# EAGLE design RevE-light (EAGLE 6.4)

## Sheet 1 of 2
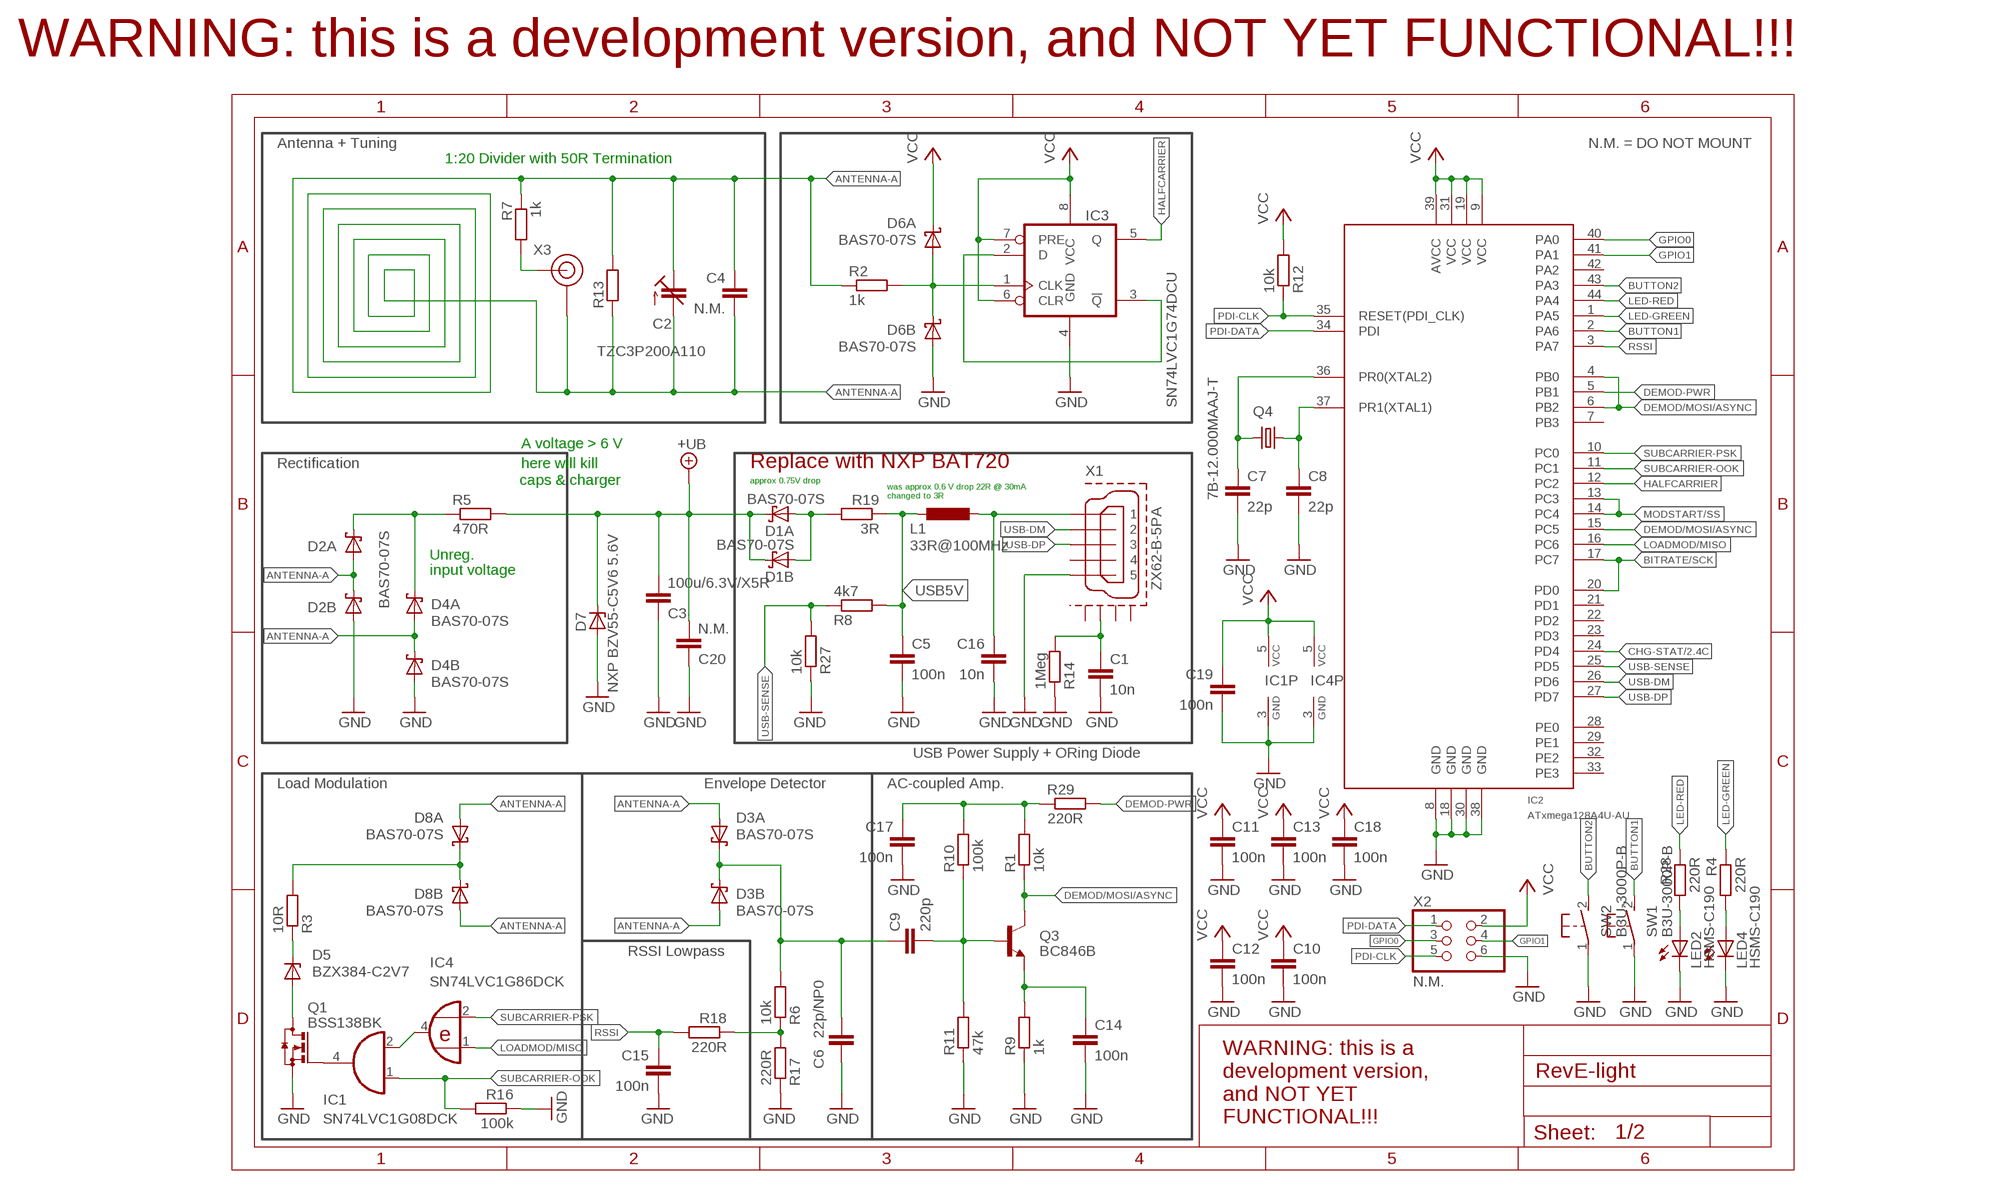
[diagram p0: schematic, sheet 1]

### Parts
C1  10n  C-EUC1206K  [C1206K]
C2  TZC3P200A110  TZC3P  [TZC3P]
C3  100u/6.3V/X5R  C-EUC1206K  [C1206K]
C4  N.M.  C-EUC1206  [C1206]
C5  100n  C-EUC1206K  [C1206K]
C6  22p/NP0  C-EUC0603K  [C0603K]
C7  22p  C-EUC0603K  [C0603K]
C8  22p  C-EUC0603K  [C0603K]
C9  220p  C-EUC0603K  [C0603K]
C10  100n  C-EUC0603K  [C0603K]
C11  100n  C-EUC0603K  [C0603K]
C12  100n  C-EUC0603K  [C0603K]
C13  100n  C-EUC0603K  [C0603K]
C14  100n  C-EUC0603K  [C0603K]
C15  100n  C-EUC0603K  [C0603K]
C16  10n  C-EUC1206K  [C1206K]
C17  100n  C-EUC0603K  [C0603K]
C18  100n  C-EUC0603K  [C0603K]
C19  100n  C-EUC0603K  [C0603K]
C20  N.M.  C-EUC1206K  [C1206K]
D1  BAS70-07S  [SOT363_PHILIPS]
D2  BAS70-07S  [SOT363_PHILIPS]
D3  BAS70-07S  [SOT363_PHILIPS]
D4  BAS70-07S  [SOT363_PHILIPS]
D5  BZX384-C2V7  BZX384  [SOD323]
D6  BAS70-07S  [SOT363_PHILIPS]
D7  NXP BZV55-C5V6 5.6V  ZENER-DIODESOD80C  [SOD80C]
D8  BAS70-07S  [SOT363_PHILIPS]
IC1  SN74LVC1G08DCK  74LVC1G08DCK  [SC70-5]
IC2  ATxmega128A4U-AU  ATXMEGA_A4-A  [TQFP44]
IC3  SN74LVC1G74DCU  74LVC1G74DC  [VSSOP8]
IC4  SN74LVC1G86DCK  74AHC1G86DCK  [SC70-5]
L1  33R@100MHz  L-EUL2012C  [L2012C]
LED2  HSMS-C190  LEDCHIPLED_0603  [CHIPLED_0603]
LED4  HSMS-C190  LEDCHIPLED_0603  [CHIPLED_0603]
Q1  BSS138BK  BSS123  [SOT23]
Q3  BC846B  BC846BSMD  [SOT23]
Q4  7B-12.000MAAJ-T  TXC7B  [5MMX3.2MM]
R1  10k  R-EU_R0603  [R0603]
R2  1k  R-EU_R0603  [R0603]
R3  10R  R-EU_R0603  [R0603]
R4  220R  R-EU_R0603  [R0603]
R5  470R  R-EU_R1206  [R1206]
R6  10k  R-EU_R0603  [R0603]
R7  1k  R-EU_R1206  [R1206]
R8  4k7  R-EU_R0603  [R0603]
R9  1k  R-EU_R0603  [R0603]
R10  100k  R-EU_R0603  [R0603]
R11  47k  R-EU_R0603  [R0603]
R12  10k  R-EU_R0603  [R0603]
R13  R-EU_M1206  [M1206]
R14  1Meg  R-EU_M0805  [M0805]
R16  100k  R-EU_R0603  [R0603]
R17  220R  R-EU_R0603  [R0603]
R18  220R  R-EU_R0603  [R0603]
R19  3R  R-EU_M0805  [M0805]
R27  10k  R-EU_R0603  [R0603]
R28  220R  R-EU_R0603  [R0603]
R29  220R  R-EU_R0603  [R0603]
SW1  B3U-3000P-B  [B3U-3000P-B]
SW2  B3U-3000P-B  [B3U-3000P-B]
X1  ZX62-B-5PA  ZX62-B-5PA-LONG  [ZX62-B-5PA-LONG]
X2  N.M.  PINHD-2X3-2.54-EDGE  [PINHD-2X3-2.54-EDGE]
X3  U.FL-R-SMT  [U.FL-R-SMT]

### Nets
+UB: C3.2 C20.2 D1.3(B:C) D1.6(A:C) D7.C R5.2 ; also sheet 2
ANTENNA-A: C2.1(A) C2.2(E) C4.1 C4.2 D2.1(A:A) D2.3(B:C) D3.1(A:A) D3.4(B:A) D4.1(A:A) D4.3(B:C) D8.1(A:A) D8.4(B:A) R2.1 R7.1 R13.1 R13.2 X3.GND2(GND)
BITRATE/SCK: IC2.17(PC7) IC2.20(PD0)
BUTTON1: IC2.2(PA6) SW1.2(S)
BUTTON2: IC2.43(PA3) SW2.2(S)
CHG-STAT: IC2.24(PD4) ; also sheet 2
DEMOD-PWR: IC2.5(PB1) R29.2
DEMOD/MOSI/ASYNC: IC2.4(PB0) IC2.6(PB2) IC2.15(PC5) Q3.3(C) R1.1
GND: C1.2 C3.1 C5.2 C6.2 C7.2 C8.2 C10.2 C11.2 C12.2 C13.2 C14.2 C15.2 C16.2 C17.2 C18.2 C19.2 C20.1 D2.4(B:A) D4.4(B:A) D6.4(B:A) D7.A IC1.3(GND) IC2.8(GND) IC2.18(GND) IC2.30(GND) IC2.38(GND) IC3.4(GND) IC4.3(GND) LED2.C LED4.C Q1.2(S) R9.1 R11.1 R14.1 R16.1 R17.1 R27.1 SW1.1(P) SW2.1(P) X1.5 X2.6 ; also sheet 2
GPIO0: IC2.40(PA0) X2.3
GPIO1: IC2.41(PA1) X2.4
HALFCARRIER: IC2.12(PC2) IC3.5(Q)
LED-GREEN: IC2.1(PA5) R4.1
LED-RED: IC2.44(PA4) R28.1
LOADMOD/MISO: IC2.16(PC6) IC4.1(I0)
MOD-DEMOD: D8.3(B:C) D8.6(A:C) R3.2
MOD-DEMOD1: C6.1 C9.1 D3.3(B:C) D3.6(A:C) R6.2
MODSTART/SS: IC2.13(PC3) IC2.14(PC4)
N$1: C14.1 Q3.2(E) R9.2
N$3: D5.2(A) Q1.3(D)
N$4: IC3.2(D) IC3.3(!Q)
N$5: C7.1 IC2.36(PR0(XTAL2)) Q4.3
N$6: R6.1 R17.2 R18.1
N$7: C16.1 L1.1 X1.1
N$8: C8.1 IC2.37(PR1(XTAL1)) Q4.1
N$9: LED2.A R28.2
N$10: D2.6(A:C) D4.6(A:C) R5.1
N$11: IC1.2(I1) IC4.4(O)
N$12: D5.1(C) R3.1
N$13: LED4.A R4.2
N$14: IC1.4(O) Q1.1(G)
N$15: R7.2 X3.SIG
N$56: C9.2 Q3.1(B) R10.1 R11.2
N$59: C1.1 R14.2 X1.P$2(GND2)
N$66: D1.1(A:A) D1.4(B:A) R19.2
N$1234: D6.1(A:A) D6.3(B:C) IC3.1(CLK) R2.2
N$12345: C17.1 R1.2 R10.2 R29.1
PDI-CLK: IC2.35(RESET(PDI_CLK)) R12.1 X2.5
PDI-DATA: IC2.34(PDI) X2.1
RSSI: C15.1 IC2.3(PA7) R18.2
SUBCARRIER-OOK: IC1.1(I0) IC2.11(PC1) R16.2
SUBCARRIER-PSK: IC2.10(PC0) IC4.2(I1)
USB5V: C5.1 L1.2 R8.2 R19.1
USB-DM: IC2.26(PD6) X1.2
USB-DP: IC2.27(PD7) X1.3
USB-SENSE: IC2.25(PD5) R8.1 R27.2
VCC: C10.1 C11.1 C12.1 C13.1 C18.1 C19.1 D6.6(A:C) IC1.5(VCC) IC2.9(VCC) IC2.19(VCC) IC2.31(VCC) IC2.39(AVCC) IC3.6(CLR) IC3.7(PRE) IC3.8(VCC) IC4.5(VCC) R12.2 X2.2 ; also sheet 2
Unconnected: IC2.7(PB3) IC2.21(PD1) IC2.22(PD2) IC2.23(PD3) IC2.28(PE0) IC2.29(PE1) IC2.32(PE2) IC2.33(PE3) IC2.42(PA2) X1.4 X1.P$1(GND1) X1.P$5(GND4) X1.P$6(GND3) X3.GND1(GND)

### Notes on the sheet
- WARNING: this is a development version, and NOT YET FUNCTIONAL!!!
- Antenna + Tuning | N.M. = DO NOT MOUNT
- 1:20 Divider with 50R Termination
- A voltage > 6 V
- Rectification | here will kill | Replace with NXP BAT720
- caps & charger | approx 0.75V drop
- was approx 0.6 V drop 22R @ 30mA
  changed to 3R
- Unreg.
- input voltage
- USB Power Supply + ORing Diode
- Load Modulation | Envelope Detector | AC-coupled Amp.
- RSSI Lowpass
- WARNING: this is a 
  development version,
  and NOT YET 
  FUNCTIONAL!!!

## Sheet 2 of 2
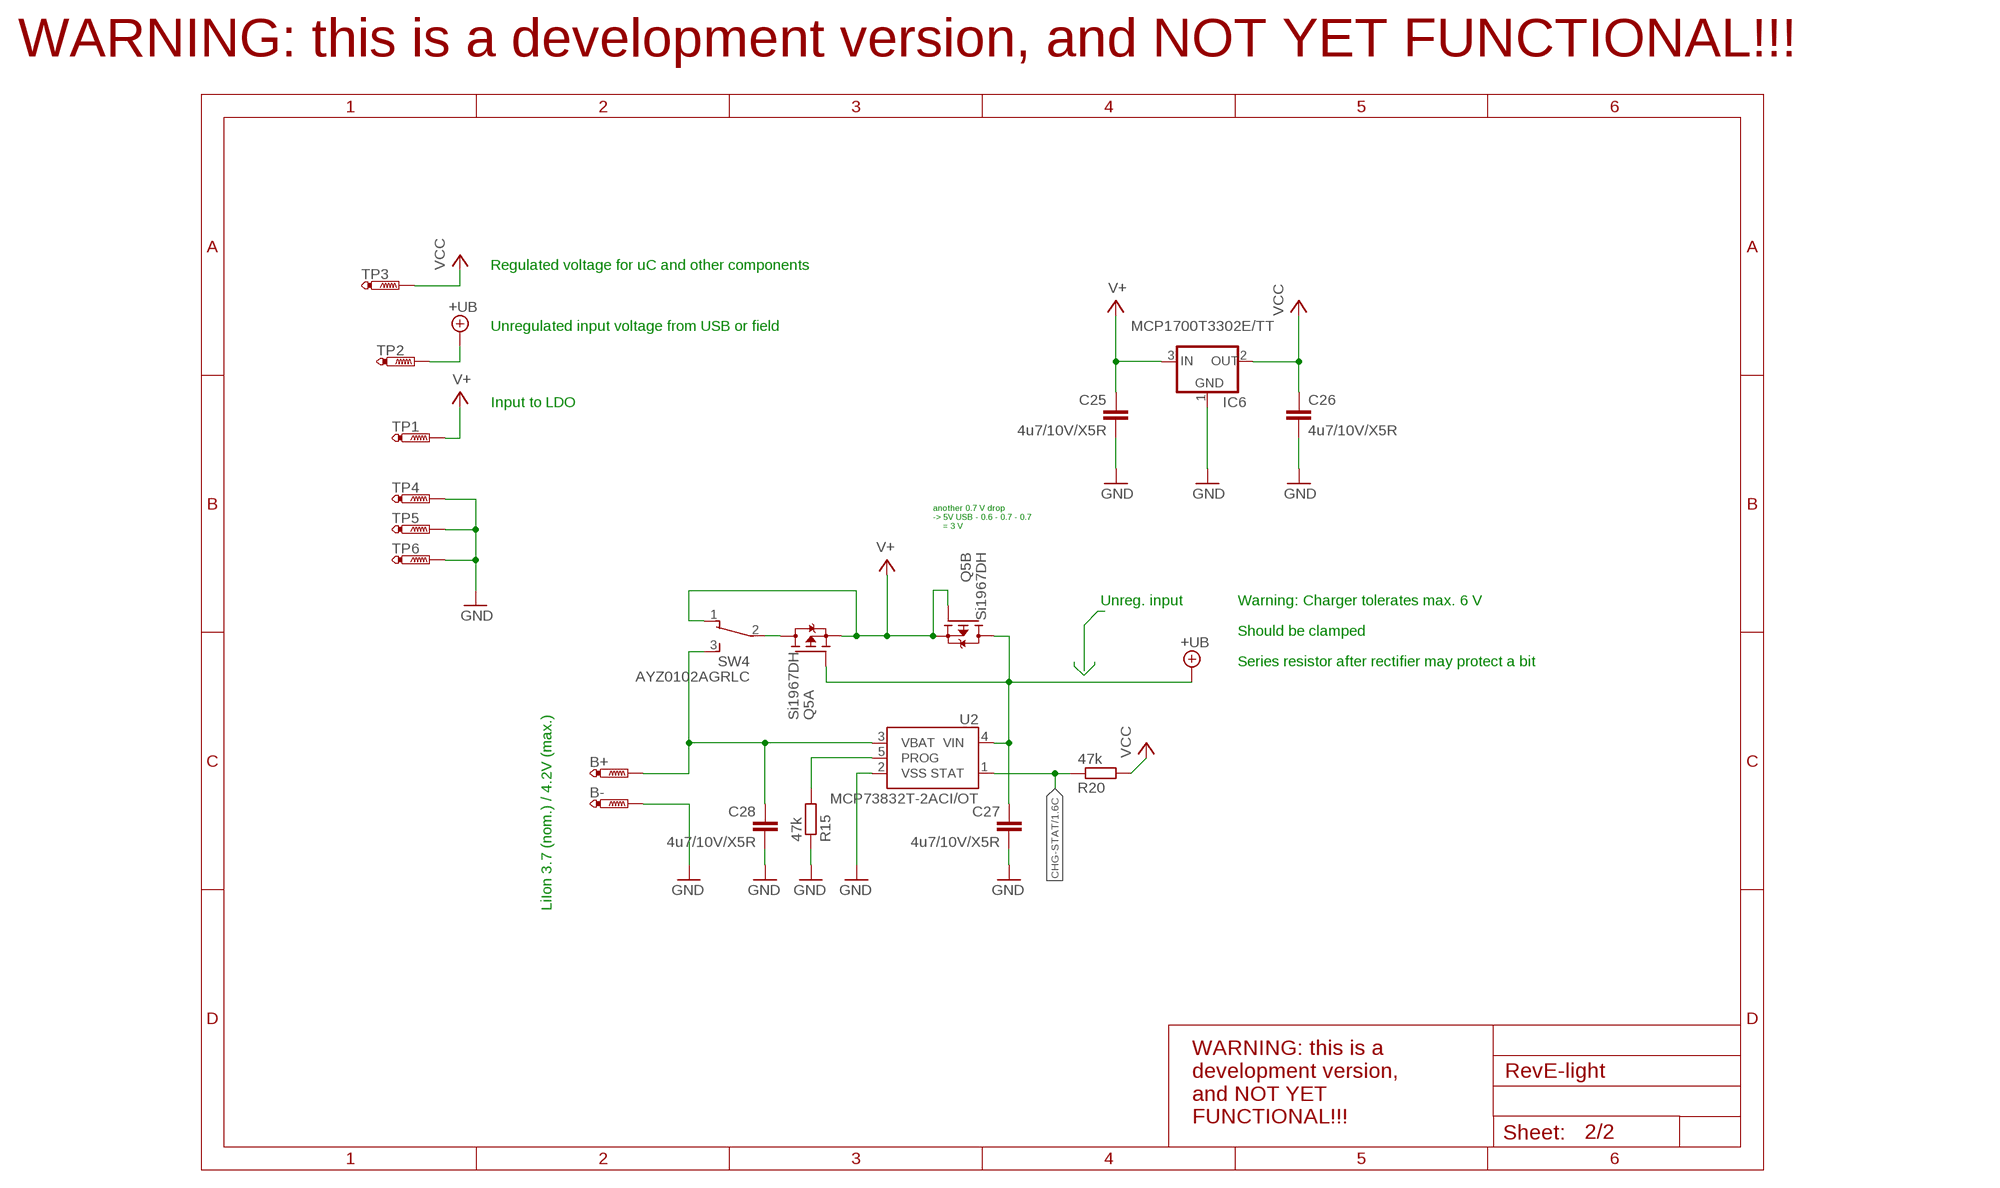
[diagram p1: schematic, sheet 2]

### Parts
B+  PTR1TP18SQ  [TP18SQ]
B-  PTR1TP18SQ  [TP18SQ]
C25  4u7/10V/X5R  C-EUC0603K  [C0603K]
C26  4u7/10V/X5R  C-EUC0603K  [C0603K]
C27  4u7/10V/X5R  C-EUC0603K  [C0603K]
C28  4u7/10V/X5R  C-EUC0603K  [C0603K]
IC6  MCP1700T3302E/TT  MCP1702  [SOT23]
Q5  Si1967DH  BSS84AKS  [SOT363]
R15  47k  R-EU_R0603  [R0603]
R20  47k  R-EU_R0603  [R0603]
SW4  AYZ0102AGRLC  [AYZ0102AGRLC]
TP1  PTR1TP07R  [TP07R]
TP2  PTR1TP07R  [TP07R]
TP3  PTR1TP07R  [TP07R]
TP4  PTR1TP07R  [TP07R]
TP5  PTR1TP07R  [TP07R]
TP6  PTR1TP07R  [TP07R]
U2  MCP73832T-2ACI/OT  MCP73831  [SOT23-5]

### Nets
+UB: C27.1 Q5.2(A:G) Q5.3(B:D) TP2.TP U2.4(VIN) ; also sheet 1
CHG-STAT: R20.1 U2.1(STAT) ; also sheet 1
GND: B-.TP C25.2 C26.2 C27.2 C28.2 IC6.1(GND) R15.1 TP4.TP TP5.TP TP6.TP U2.2(VSS) ; also sheet 1
N$20: B+.TP C28.1 SW4.3(S) U2.3(VBAT)
N$22: R15.2 U2.5(PROG)
N$23: Q5.6(A:D) SW4.2(P)
V+: C25.1 IC6.3(IN) Q5.1(A:S) Q5.4(B:S) Q5.5(B:G) SW4.1(O) TP1.TP
VCC: C26.1 IC6.2(OUT) R20.2 TP3.TP ; also sheet 1

### Notes on the sheet
- WARNING: this is a development version, and NOT YET FUNCTIONAL!!!
- Regulated voltage for uC and other components
- Unregulated input voltage from USB or field
- Input to LDO
- another 0.7 V drop
  -> 5V USB - 0.6 - 0.7 - 0.7
      = 3 V
- Unreg. input | Warning: Charger tolerates max. 6 V
- Should be clamped
- Series resistor after rectifier may protect a bit
- LiIon 3.7 (nom.) / 4.2V (max.)
- WARNING: this is a 
  development version,
  and NOT YET 
  FUNCTIONAL!!!

## Library data of the parts
B+ B- TP1-TP6 = testpad:PTR1: TEST PIN
C1 C3-C20 C25-C28 = rcl:C-EU: CAPACITOR, European symbol
C2 = Murata-TZC3P:TZC3P
D1-D4 D6 D8 = diode:BAS70-07: Silicon Schottky Diodes General-purpose diode for high-speed switching Source: BAS70_1PS7XSB70_SER_8.pdf
D5 = NXP-BZX384:BZX384
D7 = diode:ZENER-DIODE: Z-Diode
IC1 = 74xx-little-de:74*1G08: 2-input AND gate
IC2 = _ATxmega:ATXMEGA_A4
IC3 = 74LVC1G74:74LVC1G74
IC4 = 74xx-little-de:74*1G86: 2-input EXCLUSIV-OR gate
IC6 = Microchip-MCP1702:MCP1702
L1 = rcl:L-EU: INDUCTOR, European symbol
LED2 LED4 = led:LED: LED OSRAM: - CHIPLED LG R971, LG N971, LY N971, LG Q971, LY Q971, LO R971, LY R971 LH N974, LH R974 LS Q976, LO Q976, LY Q976 LO Q996 - Hyper CHIPLED LW Q18S LB Q993, LB Q99A, LB R99A - SideLED LS A670, LO A670, LY A670, LG A670, LP A670 LB A673, LV A673, LT A673, LW A673 LH A674 LY A675 LS A676, LA A676, LO A676, LY A676, LW A676 LS A679, LY A679, LG A679 - Hyper Micro SIDELED® LS Y876, LA Y876, LO Y876, LY Y876 LT Y87S - SmartLED LW L88C, LW L88S LB L89C, LB L89S, LG L890 LS L89K, LO L89K, LY L89K LS L896, LA L896, LO L896, LY L896 - TOPLED LS T670, LO T670, LY T670, LG T670, LP T670 LSG T670, LSP T670, LSY T670, LOP T670, LYG T670 LG T671, LOG T671, LSG T671 LB T673, LV T673, LT T673, LW T673 LH T674 LS T676, LA T676, LO T676, LY T676, LB T676, LH T676, LSB T676, LW T676 LB T67C, LV T67C, LT T67C, LS T67K, LO T67K, LY T67K, LW E67C LS E67B, LA E67B, LO E67B, LY E67B, LB E67C, LV E67C, LT E67C LW T67C LS T679, LY T679, LG T679 LS T770, LO T770, LY T770, LG T770, LP T770 LB T773, LV T773, LT T773, LW T773 LH T774 LS E675, LA E675, LY E675, LS T675 LS T776, LA T776, LO T776, LY T776, LB T776 LHGB T686 LT T68C, LB T68C - Hyper Mini TOPLED® LB M676 - Mini TOPLED Santana® LG M470 LS M47K, LO M47K, LY M47K Source: http://www.osram.convergy.de LUXEON: - LUMILED® LXK2-PW12-R00, LXK2-PW12-S00, LXK2-PW14-U00, LXK2-PW14-V00 LXK2-PM12-R00, LXK2-PM12-S00, LXK2-PM14-U00 LXK2-PE12-Q00, LXK2-PE12-R00, LXK2-PE12-S00, LXK2-PE14-T00, LXK2-PE14-U00 LXK2-PB12-K00, LXK2-PB12-L00, LXK2-PB12-M00, LXK2-PB14-N00, LXK2-PB14-P00, LXK2-PB14-Q00 LXK2-PR12-L00, LXK2-PR12-M00, LXK2-PR14-Q00, LXK2-PR14-R00 LXK2-PD12-Q00, LXK2-PD12-R00, LXK2-PD12-S00 LXK2-PH12-R00, LXK2-PH12-S00 LXK2-PL12-P00, LXK2-PL12-Q00, LXK2-PL12-R00 Source: www.luxeon.com KINGBRIGHT: KA-3528ASYC Source: www.kingbright.com
Q1 = transistor-small-signal:BSS123: N-CHANNEL MOS FET
Q3 = transistor-npn:BC846*: NPN Transistor
Q4 = TXC-Crystal:TXC7B
Q5 = NXP-MOS:BSS84AKS
R1-R20 R27-R29 = rcl:R-EU_: RESISTOR, European symbol
SW1 SW2 = Omron-B3U:B3U-3000P
SW4 = C&K-Switch:AYZ0102AGRLC
U2 = SparkFun:MCP73831: Microchip's MCP73831 Miniature single cell, fully integrated Li-Ion, Li-polymer charge management controller http://ww1.microchip.com/downloads/en/DeviceDoc/21984a.pdf
X1 = Hirose-USB:ZX62-B-5PA
X2 = PINHD:PINHD-2X3
X3 = Hirose-UFL:U.FL-R-SMT

## Board
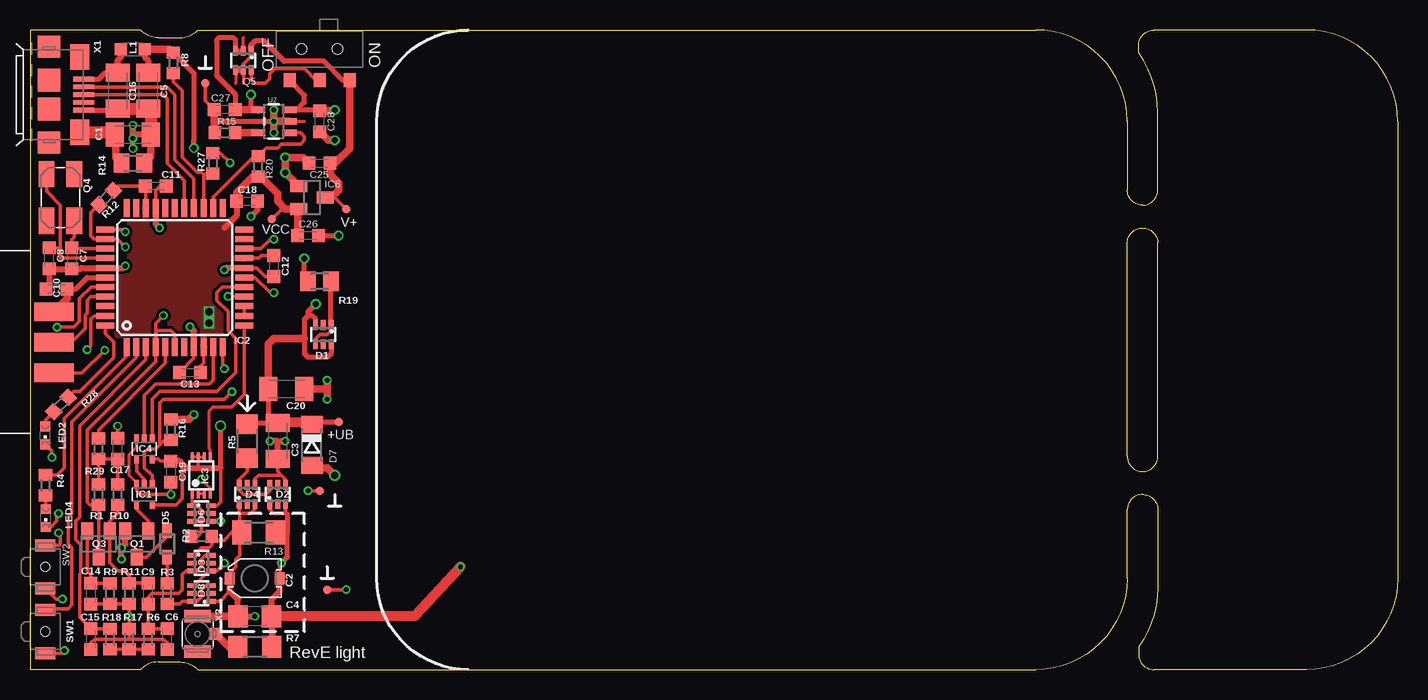
[diagram p2: board, top side]
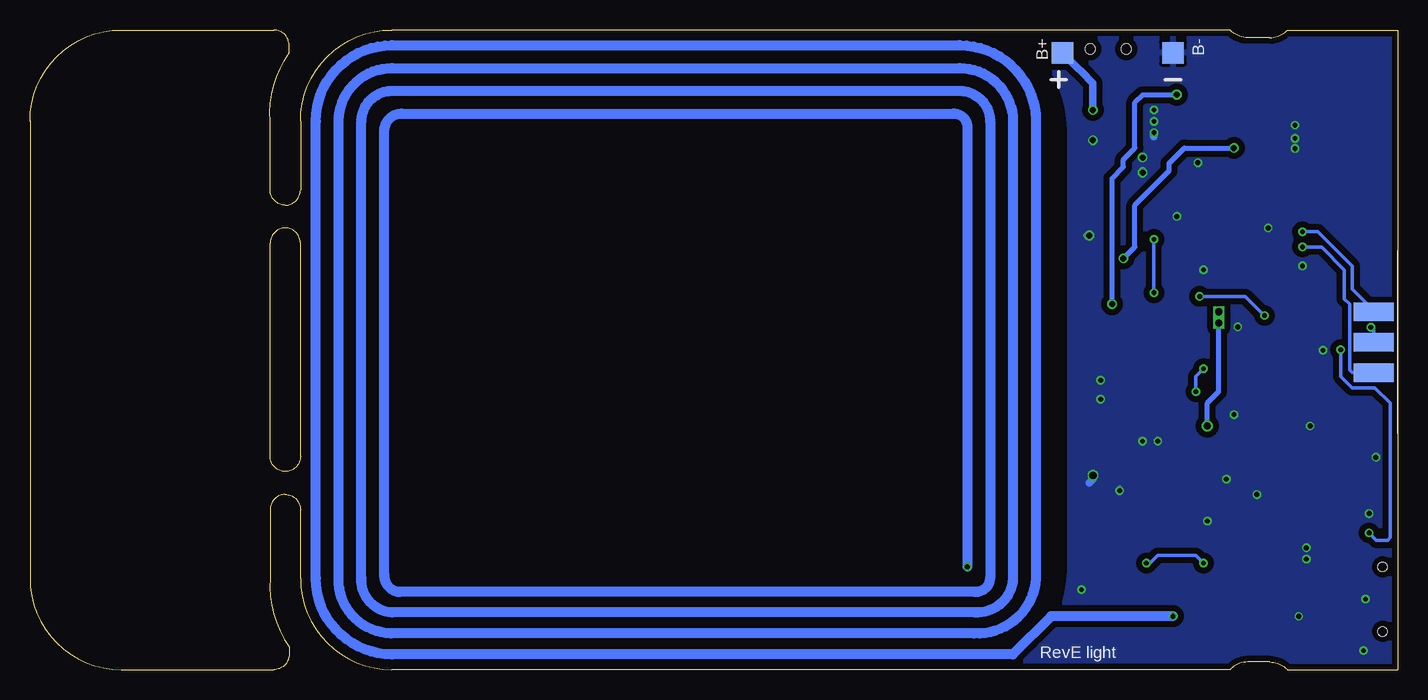
[diagram p3: board, bottom side, seen from below]

Size 113.98 x 53.34 mm. Coordinates in mm from the lower left corner, seen from the top.
Outline: 10.67,52.7 arc-45 9.26,53.29
Outline: 12.51,52.7 arc45 13.92,53.29
Outline: 10.67,52.7 arc-45 9.26,53.29
Outline: 9.26,53.29 9.21,53.34 0,53.34 0,0 9.21,0 9.26,0.05 arc-45 10.67,0.63 12.51,0.63 arc-45 13.92,0.05 13.97,0 83.82,0 arc90 91.44,7.62 91.44,13.33 arc-90 92.71,14.61 arc-90 93.98,13.33 93.98,7.62 arc-38 92.39,1.9 92.39,1.27 arc90 93.66,0 106.36,0 arc90 113.98,7.62 113.98,45.72 arc90 106.36,53.34 93.66,53.34 arc90 92.39,52.07 92.39,51.44 arc-38 93.98,45.72 93.98,40 arc-90 92.71,38.73 arc-90 91.44,40 91.44,45.72 arc90 83.82,53.34 13.97,53.34 13.92,53.29
Outline: 12.51,52.7 arc45 13.92,53.29
Outline: 10.67,52.7 12.51,52.7
Outline: 93.98,17.78 93.98,35.56 arc90 92.71,36.83 arc90 91.44,35.56 91.44,17.78 arc90 92.71,16.51 arc90 93.98,17.78
Copper layers (1*16): Top 0.035mm / dielectric 1.5mm / Bottom 0.035mm
Design rules "dirt_cheap_dirty_boards.v1": minimum track width 5mil, minimum drill 12mil, track to track 5mil, track to pad 5mil, pad to pad 5mil, via to via 5mil, smd to smd 0mil, copper to edge 10mil, drill to drill 10mil, minimum pad ring 10mil, minimum via ring 6mil, stop-mask expansion 2mil, vias tented up to drill 25mil, thermal gap 10mil
Milling: 44 lines

### Footprints (pad centres in the part's own frame; a part is rotated, then mirrored left to right if it is on the bottom)
TP18SQ = smd 1.8 x 1.8: TP 0,0
C1206K = smd 1.5 x 2: 1 -1.5,0; 2 1.5,0
TZC3P = smd 1 x 0.85: 1 0,2.075; 2 0,-2.075
C1206 = smd 1.6 x 1.8: 1 -1.4,0; 2 1.4,0
C0603K = smd 1.05 x 1.08: 1 -0.875,0; 2 0.875,0
SOT363_PHILIPS = smd 0.4 x 0.8: 1 -0.65,-0.8; 2 0,-0.8; 3 0.65,-0.8; 4 0.65,0.8; 5 0,0.8; 6 -0.65,0.8
SOD323 = smd 1.2 x 0.8: 1 -1.1,0; 2 1.1,0
SOD80C = smd 1.4 x 1.8: A 1.7,0; C -1.7,0
SC70-5 = smd 0.4 x 0.7: 1 -0.65,-0.85; 2 0,-0.85; 3 0.65,-0.85; 4 0.65,0.85; 5 -0.65,0.85
TQFP44 = smd 1.5 x 0.5: 1 -5.8,4; 2 -5.8,3.2; 3 -5.8,2.4; 4 -5.8,1.6; 5 -5.8,0.8; 6 -5.8,0; 7 -5.8,-0.8; 8 -5.8,-1.6; 9 -5.8,-2.4; 10 -5.8,-3.2; 11 -5.8,-4; 23 5.8,-4; 24 5.8,-3.2; 25 5.8,-2.4; 26 5.8,-1.6; 27 5.8,-0.8; 28 5.8,0; 29 5.8,0.8; 30 5.8,1.6; 31 5.8,2.4; 32 5.8,3.2; 33 5.8,4 | smd 0.5 x 1.5: 12 -4,-5.8; 13 -3.2,-5.8; 14 -2.4,-5.8; 15 -1.6,-5.8; 16 -0.8,-5.8; 17 0,-5.8; 18 0.8,-5.8; 19 1.6,-5.8; 20 2.4,-5.8; 21 3.2,-5.8; 22 4,-5.8; 34 4,5.8; 35 3.2,5.8; 36 2.4,5.8; 37 1.6,5.8; 38 0.8,5.8; 39 0,5.8; 40 -0.8,5.8; 41 -1.6,5.8; 42 -2.4,5.8; 43 -3.2,5.8; 44 -4,5.8
VSSOP8 = smd 0.75 x 0.25: 1 -1.55,0.75; 2 -1.55,0.25; 3 -1.55,-0.25; 4 -1.55,-0.75; 5 1.55,-0.75; 6 1.55,-0.25; 7 1.55,0.25; 8 1.55,0.75
SOT23 = smd 1 x 1.4: 1 -0.95,-1.1; 2 0.95,-1.1; 3 0,1.1
L2012C = smd 1 x 1: 1 -1,0; 2 1,0
CHIPLED_0603 = smd 0.8 x 0.8: A 0,-0.75; C 0,0.75
5MMX3.2MM = smd 2.2 x 1.3: 1 -1.95,-1.15; 2 1.95,-1.15; 3 1.95,1.15; 4 -1.95,1.15
SOT363 = smd 0.4 x 0.8: 1 -0.65,-0.8; 2 0,-0.8; 3 0.65,-0.8; 4 0.65,0.8; 5 0,0.8; 6 -0.65,0.8
R0603 = smd 1 x 1.1: 1 -0.85,0; 2 0.85,0
R1206 = smd 1.6 x 1.803: 1 -1.422,0; 2 1.422,0
M1206 = smd 1.6 x 2: 1 -1.4,0; 2 1.4,0
M0805 = smd 1.3 x 1.6: 1 -0.95,0; 2 0.95,0
B3U-3000P-B = smd 1 x 1.7: 1 -1.8,0; 2 1.8,0 | hole 0.75: 0,0
AYZ0102AGRLC = smd 1 x 1.2: 1 -2.5,2.6; 2 0,2.6; 3 2.5,2.6 | hole 0.85: -1.5,0; 1.5,0
TP07R = smd 0.7 x 0.7: TP 0,0
SOT23-5 = smd 0.55 x 1.2: 1 -0.95,-1.3; 2 0,-1.3; 3 0.95,-1.3; 4 0.95,1.3; 5 -0.95,1.3
ZX62-B-5PA-LONG = smd 0.4 x 1.75: 1 -1.3,2.875; 2 -0.65,2.875; 3 0,2.875; 4 0.65,2.875; 5 1.3,2.875 | smd 2.1 x 1.6: P$1 -3.15,2.55; P$2 3.15,2.55 | smd 1.8 x 1.9: P$3 -4,0; P$4 4,0 | smd 1.9 x 1.9: P$5 -1.2,0; P$6 1.2,0
PINHD-2X3-2.54-EDGE = smd 3.302 x 1.524 bottom: 1 2,2.54; 3 2,0; 5 2,-2.54 | smd 3.302 x 1.524: 2 2,2.54; 4 2,0; 6 2,-2.54
U.FL-R-SMT = smd 1.05 x 2.2: GND1 -1.475,0; GND2 1.475,0 | smd 1 x 1.05: SIG 0,-1.525

### Placement (x,y rotation side)
B+  27.94,51.44 0 bottom
B-  18.73,51.44 0 bottom
C1  8.57,44.61 0 top
C2  18.73,7.62 90 top
C3  20.64,19.05 90 top
C4  18.73,4.45 180 top
C5  9.84,48.26 270 top
C6  11.43,2.54 270 top
C7  3.49,34.29 270 top
C8  1.59,34.29 270 top
C9  9.84,6.35 90 top
C10  2.22,31.75 180 top
C11  10.48,40.32 0 top
C12  20.32,33.66 270 top
C13  13.34,24.76 180 top
C14  5.08,6.35 270 top
C15  5.08,2.54 270 top
C16  7.3,48.26 270 top
C17  7.3,18.42 90 top
C18  18.1,39.05 0 top
C19  11.75,16.51 270 top
C20  21.37,23.4 180 top
C25  24.13,42.23 180 top
C26  23.18,36.19 0 top
C27  16.23,46.71 180 top
C28  24.13,45.72 270 top
D1  24.45,27.94 180 top
D2  20.64,14.61 0 top
D3  14.29,8.89 270 top
D4  18.1,14.61 0 top
D5  11.43,10.48 90 top
D6  14.29,13.02 270 top
D7  23.5,18.73 270 top
D8  14.29,6.35 90 top
IC1  9.53,14.61 180 top
IC2  12.07,32.7 90 top
IC3  14.29,16.19 90 top
IC4  9.53,18.42 180 top
IC6  23.5,39.37 270 top
L1  8.57,51.75 0 top
LED2  1.27,19.53 180 top
LED4  1.31,12.62 180 top
Q1  8.89,10.48 180 top
Q3  5.71,10.48 180 top
Q4  2.54,39.37 270 top
Q5  17.78,50.8 180 top
R1  5.71,14.61 90 top
R2  14.29,11.11 180 top
R3  11.43,6.35 270 top
R4  1.3,15.37 270 top
R5  18.1,19.05 90 top
R6  9.84,2.54 90 top
R7  18.73,1.9 180 top
R8  11.95,50.6 90 top
R9  6.67,6.35 90 top
R10  7.3,14.61 90 top
R11  8.26,6.35 90 top
R12  6.35,39.37 45 top
R13  19.05,11.43 180 top
R14  8.57,42.23 180 top
R15  16.23,44.77 0 top
R16  11.75,20 270 top
R17  8.26,2.54 270 top
R18  6.67,2.54 90 top
R19  24.13,32.39 0 top
R20  19.01,41.95 270 top
R27  15.24,42.23 270 top
R28  2.59,22.11 225 top
R29  5.71,18.42 90 top
SW1  1.27,3.18 90 top
SW2  1.27,8.57 90 top
SW4  24.13,51.75 180 top
TP1  26.35,38.42 0 top
TP2  25.72,20.64 0 top
TP3  20.14,37.57 0 top
TP4  24.13,14.92 0 top
TP5  24.77,6.67 0 top
TP6  14.61,48.89 0 top
U2  20.32,45.72 90 top
X1  1.59,47.94 270 top
X2  0,27.3 0 top
X3  13.97,2.98 90 top

### Tracks (layer width: path | path; a pad name or v marks a point on that pad's centre or on a via)
+UB  (via drill 0.5)
  Top 0.254: Q5.2 17.78,52.7
  Top 0.305: Q5.3 17.14,51.59
  Top 0.406: D1.6 25.1,26.37 24.77,26.04 23.18,26.04 22.86,26.35 22.86,27.62 22.86,29.21 23.18,29.53 | D1.3 23.8,29.22 23.49,29.53 23.18,29.53 | R5.2 18.65,20.55 C3.2 | Q5.3 Q5.2 | 17.14,51.59 17.14,52.39 arc90 16.83,52.7 15.88,52.7 arc90 15.56,52.39 15.56,49.53 17.11,47.98 C27.1 | 23.18,29.53 23.18,29.85 v23.81,30.48 | v18.42,47.94 18.42,46.71 | C20.2 19.87,21.32 C3.2 | 23.18,20 23.18,20.43 D7.C 23.49,20.64 TP2.TP | C3.2 20.96,20.55 20.96,20.64
  Top 0.5: 20.56,20.47 C3.2
  Top 0.61: U2.4 18.98,46.71 18.42,46.71 C27.1 | C20.2 19.87,27.17 20.32,27.62 22.86,27.62
  Top 0.813: 20.96,20.64 23.49,20.64
  Bottom 0.406: v23.81,30.48 23.81,40.96 22.86,41.91 22.86,42.55 21.91,43.5 21.91,47.31 21.27,47.94 v18.42,47.94
ANTENNA-A  (via drill 0.4)
  Top 0.3: D2.1 19.99,13.35 20.32,13.02 21.27,13.02 21.29,13.03 D2.3 | D4.3 18.75,13.35 18.42,13.02 17.46,13.02 | 17.46,13.02 17.45,13.03 D4.1 17.29,13.65 | D3.1 13.67,9.54 14.29,10.16 14.92,10.16 15.14,10.38 R2.1 | D8.4 13.67,7 14.91,8.24 D3.4 15.54,8.24 v16.19,8.89 | D8.1 15.84,5.7 16.66,6.52 | C2.1 16.66,8.09 17.14,8.57 | 17.46,12.06 17.46,13.02 | C2.2 20.81,8.89 v20.96,8.89
  Top 0.305: 17.46,12.06 16.83,11.43 | 16.83,11.43 16.19,10.79 15.46,10.79 R2.1 | R13.2 17.46,11.43 | 17.46,11.43 16.83,11.43 | 17.14,8.57 17.14,9.21 17.46,9.52 17.46,11.43
  Top 0.406: 21.44,11.43 21.44,9.38 v20.96,8.89 | 21.44,11.43 R13.1 | 21.29,13.03 arc-90 21.44,12.88 21.44,11.43
  Top 0.5: R7.1 20.15,4.42 C4.1 20.13,5.84 20.81,6.52 C2.2 | C4.2 17.33,5.84 16.66,6.52 C2.1 | C4.2 v18.73,4.45 | 17.22,4.33 C4.2
  Top 0.61: X3.GND2 C4.2
  Top 0.813: C4.1 32.07,4.45 v35.88,8.57
  Bottom 0.305: v16.19,8.89 16.83,9.52 20,9.52 20.64,8.89 v20.96,8.89
  Bottom 0.813: v35.88,8.57 35.88,45.4 arc-90 37.15,46.36 82.87,46.36 arc-90 84.45,45.09 84.45,7.94 arc-90 83.18,6.47 35.24,6.47 arc-90 33.97,7.62 33.97,45.72 arc-90 36.51,48.26 83.82,48.26 arc-90 86.36,45.72 86.36,7.62 arc-90 83.82,4.76 35.24,4.76 arc-90 32.07,7.62 32.07,45.72 arc-90 36.51,50.17 83.82,50.17 arc-90 88.26,45.72 88.26,7.62 arc-90 83.9,3.02 35.32,3.02 arc-90 30.16,7.62 30.16,45.72 arc-90 36.51,52.07 83.82,52.07 arc-90 90.17,45.72 90.17,7.62 arc-90 83.82,1.27 32.07,1.27 28.89,4.45 v18.73,4.45
BITRATE/SCK  (via drill 0.4)
  Top 0.3: IC2.17 18.73,32.7 20,31.43 v20.32,31.43 | v20.32,35.88 20,35.88 19.23,35.1 IC2.20
  Bottom 0.3: v20.32,31.43 v20.32,35.88
BUTTON1
  Top 0.3: 8.86,26.01 3.49,20.64 3.49,13.33
  Top 0.305: 8.86,26.01 IC2.2 | 3.49,13.33 3.49,13.02 3.17,12.7 3.17,10.48 3.49,10.16 3.49,5.4 3.17,5.08 1.9,5.08 | 1.9,5.08 1.37,5.08 SW1.2 1.8,4.97 1.9,5.08
BUTTON2  (via drill 0.4)
  Top 0.305: IC2.43 5.34,29.5 5.08,29.25 5.08,26.99 v4.76,26.67 | SW2.2 2.44,10.37 2.54,10.48 2.54,11.25 v2.39,11.4
  Bottom 0.305: v4.76,26.67 4.76,24.45 3.81,23.5 1.9,23.5 0.63,22.22 0.63,11.01 0.85,10.79 1.78,10.79 v2.39,11.4
CHG-STAT
  Top 0.305: U2.1 22.54,44.77 22.86,44.45 22.86,44.13 22.54,43.81 20.96,43.81 20.64,43.5 19.71,43.5 R20.1 18.67,42.8 15.27,39.39 IC2.24
DEMOD-PWR
  Top 0.3: R29.2 5.71,20 11.27,25.55 IC2.5
DEMOD/MOSI/ASYNC  (via drill 0.4)
  Top 0.3: Q3.3 R1.1 4.98,13.75 4.76,13.97 4.76,20 10.46,25.71 IC2.4 10.46,28.26 | IC2.15 v16.52,31.1 v16.51,31.11 | 10.46,28.26 10.46,28.88 v11.11,29.53 | IC2.6 12.06,27.94 11.75,28.26 10.46,28.26
  Bottom 0.3: v16.51,31.11 12.7,31.11 v11.11,29.53
GND  (via drill 0.4, 0.5, 0.6)
  Top 0.25: D6.4 15.89,12.37 v15.88,12.38 | 8.88,15.57 8.26,16.19 8.26,17.94 8.88,18.56 IC4.3 | IC3.4 15.04,15.12 v14.29,15.87
  Top 0.254: U2.2 22.86,45.72
  Top 0.3: D2.4 21.29,15.86 20.96,16.19 | D4.4 18.75,15.89 19.05,16.19 20.96,16.19 | C3.1 20.64,16.51 20.96,16.19 | C15.2 5.08,2.22 5.4,2.54 8.26,2.54 | C6.2 11.43,2.22 11.11,2.54 8.26,2.54 | 8.26,2.54 R17.1 v8.26,4.45 R11.1 R9.1 6.64,5.47 C14.2 | IC2.18 18.88,33.5 19.61,32.78 C12.2 | C17.2 v7.3,20.32 | IC2.30 10.46,39.99 10.79,40.32 C11.2 | 8.88,15.57 IC1.3 8.88,14.94 9.21,14.61 v11.75,14.61 C19.2 | SW1.1 2.65,1.38 v2.86,1.59 | IC2.8 13.67,25.97 C13.2
  Top 0.305: v2.38,13.02 2.22,12.86 2.22,12.38 1.71,11.87 LED4.C | v1.82,17.7 1.82,18.22 LED2.C | X2.6 2.04,24.72 4.32,24.72 v6.23,26.63 | SW2.1 2.17,5.87 v2.7,5.87 | R27.1 15.86,43.08 v16.67,42.27 | TP4.TP v23.18,14.92 | TP6.TP 14.6,47.46 C27.2 | TP5.TP v26.35,6.67
  Top 0.4: X1.5 7.19,46.64 C16.2
  Top 0.406: v8.57,43.46 v8.57,44.29 | 15.36,45.77 15.41,45.72 v20.32,45.72 | C26.2 v25.72,36.19 | R14.1 | D7.A 23.49,16.83
  Top 0.5: C5.2 10.07,46.53 | v8.57,44.29 v8.57,45.4 8.57,44.61 C1.2 | v7.94,33.66 7.78,33.5 IC2.38 4.29,33.5 4.21,33.42 C7.2 C8.2 1.59,31.83 C10.2 | IC2.8 13.67,28.25 v13.34,28.57 | IC2.18 16.36,33.5 v16.19,33.34 | IC2.30 10.46,37.16 v10.79,36.83 | C3.1 20.64,19.05 | 20.64,19.05 v20,19.05 | 20.64,19.05 v21.27,19.05 | Q1.2 7.94,10.48 v7.62,10.16 v7.62,9.21 | C18.2 18.97,38.34 v18.42,37.78
  Top 0.61: IC6.1 v21.27,41.44 21.27,42.55 | C25.2 22.77,42.71 v21.27,42.71 | U2.2 v20.32,45.72 | v20.32,45.72 v20.32,46.67 | v20.32,45.72 v20.32,44.77 | R15.1 15.36,44.8 15.36,45.77 C27.2 | C20.1 24.77,23.4 | v24.77,22.54 24.77,23.4 | 24.77,23.4 v24.77,24.13 | C28.2 24.84,44.13 v25.4,44.13 | R16.1 13.23,20.85 v13.65,21.27 | C1.2 10.07,42.78 R14.1 | 23.49,16.83 24.77,16.83 v25.4,16.19
  Top 1: C16.2 C5.2 | 10.07,46.53 C1.2
  Bottom 0.305: v2.7,5.87 2.86,6.03 | v23.18,14.92 23.18,15.24
  Bottom 0.406: v25.72,36.19 26.03,36.19
  Bottom 0.61: v21.27,41.44 21.27,41.59 | v20.32,44.77 20.32,44.45 | v25.4,16.19 25.4,15.87 25.72,15.56
  pour Bottom (isolate 0.5): 37.15,54.61 9.53,54.61 9.53,55.25 -1.9,55.25 -1.9,-1.91 9.53,-1.91 9.53,-1.27 37.15,-1.27 arc-90 27.31,8.25 27.31,45.09 arc-90
GPIO0  (via drill 0.4)
  Top 0.305: IC2.40 5.08,31.9 4.11,30.93 4.11,29.02 3.63,28.55 v2.25,28.55
  Bottom 0.305: v2.25,28.55 2,28.3 X2.3
GPIO1
  Top 0.305: IC2.41 5.07,31.1 4.76,30.8 4.76,29.72 4.62,29.58 4.62,28.43 3.49,27.3 X2.4
HALFCARRIER
  Top 0.25: IC3.5 15.04,18.3 14.92,18.42 14.92,21.59 15.24,21.91 15.88,21.91
  Top 0.3: IC2.12 17.86,22.94 16.83,21.91 15.88,21.91
LED-GREEN
  Top 0.3: 8.06,26.16 IC2.1
  Top 0.305: 8.06,26.16 2.86,20.96 2.86,16.83 2.25,16.22 R4.1
LED-RED
  Top 0.3: IC2.44 6.26,28.03 6.99,27.3 6.99,26.04
  Top 0.305: 6.99,26.04 4.13,23.18 3.66,23.18 R28.1
LOADMOD/MISO
  Top 0.3: IC4.1 10.17,22.56 10.79,23.18 15.56,23.18 17.14,24.76 17.14,27.62 16.51,28.26 16.51,29.85 15.56,30.8 15.56,31.43 16.03,31.9 IC2.16
MOD-DEMOD
  Top 0.3: D8.3 14.62,7 14.29,6.67 14.29,6.03 13.96,5.7 D8.6 12.68,5.7 12.49,5.5 R3.2
MOD-DEMOD1
  Top 0.3: C6.1 11.41,3.39 R6.2 C9.1 9.84,6.03 10.16,6.35 12.38,6.35 12.7,6.67 12.7,7.94 13,8.24 D3.3 13.96,8.24 14.29,8.57 14.29,9.21 14.62,9.54 D3.6
MODSTART/SS
  Top 0.3: IC2.13 IC2.14
N$1
  Top 0.3: R9.2 5.1,7.2 C14.1 5.08,7.94 4.76,8.25 Q3.2
N$3
  Top 0.3: D5.2 11.43,11.11 9.7,9.38 Q1.3
N$4
  Top 0.25: IC3.3 IC3.2
N$5
  Top 0.3: Q4.3 3.69,36.08 3.49,35.88 C7.1 3.56,35.1 IC2.36
N$6
  Top 0.3: R18.1 R17.2 R6.1
N$7
  Top 0.4: X1.1 5.74,49.24 6.26,49.76 C16.1
  Top 0.5: L1.1 7.57,51.07 7.3,50.8 C16.1
N$8
  Top 0.3: 2.54,35.24 2.54,38.73 1.39,39.89 Q4.1 | C8.1 2.46,35.17 2.54,35.24 | IC2.37 2.54,34.3 2.54,35.24
N$9
  Top 0.305: LED2.A 1.27,20.78 R28.2
N$10
  Top 0.3: R5.1 18.1,16.51 17.45,15.86 D4.6 17.45,14.94 17.78,14.61 19.68,14.61 19.99,14.91 D2.6
N$11
  Top 0.3: IC4.4 8.88,16.53 9.53,15.87 IC1.2
N$12
  Top 0.3: R3.1 D5.1
N$13
  Top 0.305: LED4.A 1.31,14.51 R4.2
N$14
  Top 0.3: IC1.4 8.88,13.35 9.84,12.38 Q1.1
N$15
  Top 0.61: X3.SIG 16.57,1.9 R7.2
N$20  (via drill 0.5)
  Top 0.406: U2.3 22.22,46.67 | 22.22,46.67 22.86,47.31 22.86,47.92 SW4.3 | C28.1 24.06,46.67 22.22,46.67
  Top 0.61: C28.1 25.32,46.59 v25.4,46.67
  Bottom 0.61: B+.TP 26.67,50.17 26.35,49.85 25.4,48.89 v25.4,46.67
N$22
  Top 0.61: R15.2 U2.5
N$23
  Top 0.305: Q5.6 18.43,49.2 18.73,48.89 19.62,48.89 19.99,49.26 19.99,49.7 20.38,50.09 22.88,50.09 23.82,49.15 SW4.2
N$56
  Top 0.3: C9.2 8.28,7.22 R11.2 8.26,7.94 7.94,8.25 7.3,8.25 6.67,8.89 Q3.1 6.67,12.38 7.3,13.02 R10.1
N$59
  Top 0.5: 4.16,44.77 X1.P$2
  Top 0.61: 7.15,44.45 7.15,42.7 R14.2
  Top 1: 4.16,44.77 7.15,44.77 7.15,44.61 | 7.15,44.61 C1.1 | 7.15,44.45 7.15,44.61
N$66
  Top 0.3: D1.1 25.1,28.91
  Top 0.305: D1.1 25.1,28.27 24.77,27.94 24.13,27.94 23.81,27.62 23.81,27.15 D1.4
  Top 0.406: D1.1 25.08,28.76 R19.2
N$1234
  Top 0.25: IC3.1 13.54,13.72 D6.1
  Top 0.3: R2.2 13.97,11.11 14.29,11.43 14.29,12.38 | D6.3 14.27,12.37 14.29,12.38 | D6.1 13.96,13.67 14.29,13.33 14.29,12.38
N$12345
  Top 0.3: R10.2 C17.1 7.28,17.57 R29.1 R1.2
PDI-CLK  (via drill 0.4)
  Top 0.3: v7.94,35.24 7.28,35.9 IC2.35 5.37,35.9 5.08,36.19 5.08,37.15
  Top 0.305: 5.08,37.15 5.08,38.1 R12.1
  Bottom 0.3: X2.5 3.81,24.76 | 4.44,33.34 6.35,35.24 v7.94,35.24
  Bottom 0.305: 4.44,33.34 4.44,30.92 4.01,30.49 4.01,24.97 3.81,24.76
PDI-DATA  (via drill 0.4)
  Top 0.3: IC2.34 7.75,36.7 v7.94,36.51
  Bottom 0.3: X2.1 1.9,29.85 3.81,31.75 3.81,33.66 6.67,36.51 v7.94,36.51
RSSI
  Top 0.3: IC2.3 9.67,25.86 4.13,20.32 4.13,13.02 | C15.1 6.64,3.41 R18.2
  Top 0.305: 4.13,13.02 4.13,12.7 3.81,12.38 3.81,10.81 4.21,10.41 4.21,8.02 4.13,7.94 4.13,4.37 C15.1
SUBCARRIER-OOK  (via drill 0.4)
  Top 0.3: IC1.1 10.17,16.18 9.53,16.83 9.53,18.1 9.84,18.42 10.48,18.42 10.79,18.73 | 10.79,18.73 10.79,22.22 11.11,22.54 16.19,22.54 v16.83,23.18 | IC2.11 16.06,25.21 v16.19,25.08 | R16.2 11.21,19.15 10.79,18.73
  Bottom 0.3: v16.83,23.18 16.83,24.45 v16.19,25.08
SUBCARRIER-PSK
  Top 0.3: IC2.10 15.27,24.15 14.92,23.81 10.48,23.81 9.53,22.86 IC4.2
USB5V  (via drill 0.5)
  Top 0.406: R8.2 13.65,49.75 13.65,44.13 v13.65,43.5 | R19.1 22.86,32.7 v22.86,34.29
  Top 0.5: L1.2 9.57,51.07 9.84,50.8 C5.1
  Top 0.61: R8.2 11.65,51.75 L1.2
  Bottom 0.406: v22.86,34.29 21.91,35.24 21.91,38.73 19.05,41.59 19.05,42.23 17.78,43.5 v13.65,43.5
USB-DM
  Top 0.3: IC2.26 13.67,40.94 12.06,42.55 12.06,47.94 11.43,48.58 4.48,48.58 X1.2
USB-DP
  Top 0.3: IC2.27 12.86,40.79 11.43,42.23 11.43,47.62 11.11,47.94 X1.3
USB-SENSE
  Top 0.305: IC2.25 14.46,41.32 | 14.46,41.32 14.29,41.5 13.95,41.5 12.7,42.75 12.7,48.26 11.95,49.01 R8.1 | R27.2 arc-90 15.18,41.32 14.46,41.32
V+
  Top 0.254: Q5.5 17.78,48.89 | Q5.4 17.14,49.99 17.14,48.89
  Top 0.305: Q5.1 18.43,51.13 17.78,50.48 Q5.5 | 25.08,39.37 25.4,39.37 TP1.TP
  Top 0.406: Q5.4 Q5.5 | SW4.1 26.07,49.15 24.5,50.73 21.17,50.73 19.43,52.47 18.81,52.47 18.42,52.07 18.42,51.62 Q5.1 | 25.4,42.23 C25.1
  Top 0.61: IC6.3 25.08,39.37 25.72,40 25.72,40.56 25,41.28 C25.1 | SW4.1 26.63,43.46 25.4,42.23
VCC  (via drill 0.6)
  Top 0.25: IC3.7 IC3.6 | IC3.7 IC3.8 | IC3.7 14.04,16.89 13.97,16.83
  Top 0.3: IC2.19 19.06,34.3 19.29,34.53 C12.1 | IC2.31 9.67,40.26 C11.1 | IC1.5 12.17,13.75 12.7,14.29 12.7,17.14 | IC4.5 10.69,17.57 10.87,17.39 C19.1 | D6.6 15.57,13.67 15.88,13.97 15.88,16.83 | IC2.9 14.46,25.58 14.21,25.32 C13.1
  Top 0.305: R12.2 7.3,40.32 C11.1 | 21.27,38.42 20.99,38.42 TP3.TP
  Top 0.406: 15.88,16.83 v15.88,20.32 | v14.92,29.85 v14.92,28.89 | C10.1 3.81,31.75 4.76,32.7 IC2.39
  Top 0.5: X2.2 2,29.94 | C19.1 12.46,17.39 12.7,17.14 13.02,16.83 13.97,16.83 15.88,16.83 | C18.1 17.22,37.86 16.19,36.83
  Top 0.61: C18.1 17.22,39.77 18.56,41.1 R20.2 19.23,41.1 20.64,39.69 20.64,39.05 21.27,38.42 IC6.2 22.3,38.33 C26.1 | C10.1 3.1,30.94 X2.2
  Bottom 0.406: v15.88,20.32 15.88,22.22 14.92,23.18 v14.92,29.85
  pour Top (isolate 0.25): 15.88,38.42 8.26,38.42 6.35,36.51 6.35,28.26 7.62,26.99 15.88,26.99 17.78,28.89 17.78,36.51

### Text on the board
Top: This is an unsupported development version, and NOT YET FUNCTIONAL!
tNames: OFF | ON | V+ | VCC | +UB | RevE light
bNames: RevE light